# Altium schematic sheet Power.SchDoc
size A4; SheetNumber: 4; SheetTotal: 5; SPICEModelCacheOQVMKSBN: <root> / <DocumentId>OQVMKSBN</DocumentId> / </root>
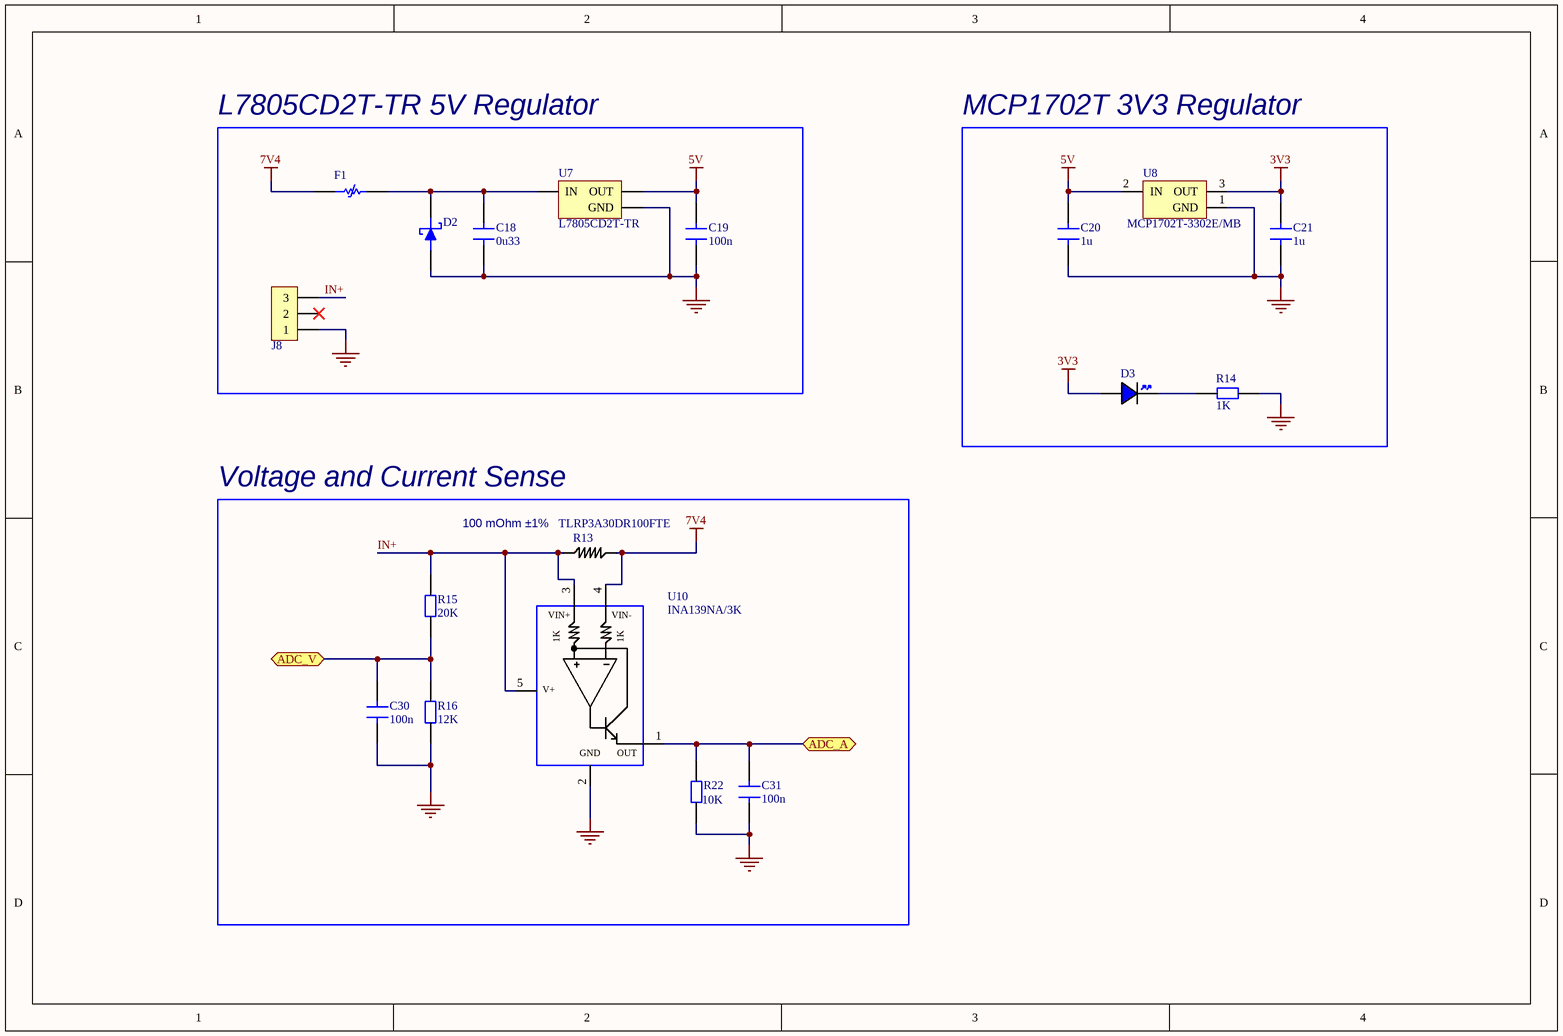
[diagram p0: Power.SchDoc]

## Parts
C18  0u33  [CAP 0805]
C19  100n  [CAP 0805]
C20  1u  [CAP 0805]
C21  1u  [CAP 0805]
C30  100n  [CAP 0805]
C31  100n  [CAP 0805]
D2  SMBJ8.5CA  [SMBJ12CA-13-F]  (value not drawn)
D3  LED 0805 BLUE  [LED 0805 BLUE]  (value not drawn)
F1  0ZCG0160AF2C  [0ZCG0075FF2C]  (value not drawn)
J8  JST B3B-XH-A  [JST_B3B-XH-A]  (value not drawn)
R13  TLRP3A30DR100FTE  [RES 2512]
R14  1K  [RES 0603]
R15  20K  [RES 0805]
R16  12K  [RES 0805]
R22  10K  [RES 0805]
U7  L7805CD2T-TR  [L7805ABD2T-TR]
U8  MCP1702T-3302E/MB  [MCP1702T-3302E/MB]
U10  INA139NA/3K  [INA139NA]

## Blocks framed on the sheet
L7805CD2T-TR 5V Regulator: C18 C19 D2 F1 J8 U7
MCP1702T 3V3 Regulator: C20 C21 D3 R14 U8
Voltage and Current Sense: C30 C31 R13 R15 R16 R22 U10

## Ports
ADC_A (bidir, see MCU[2C]), ADC_V (bidir, see MCU[2C])

## Nets
3V3: C21.2 D3.A U8.3(OUT)
5V: C19.2 C20.2 U7.3(OUT) U8.2(IN)
7V4: F1.1 R13.1 U10.4(VIN+)
GND: C18.1 C19.1 C20.1 C21.1 C30.1 C31.1 D2.1 J8.1 R14.2 R16.1 R22.1 U7.2(GND) U8.1(GND) U10.2(GND)
ADC_A: C31.2 R22.2 U10.1(OUT) ; port ADC_A
ADC_V: C30.2 R15.1 R16.2 ; port ADC_V
IN+: J8.3 R13.2 R15.2 U10.3(VIN+) U10.5(V+)
NetC18_2: C18.2 D2.2 F1.2 U7.1(IN)
NetD3_K: D3.K R14.1

Not connected (* = marked no-connect by the designer): J8 2*

## Notes on the sheet
- (near R13) 100 mOhm ±1%
- (in symbol INA139NA/3K) VIN-; 1K

## Library data of the parts
C18-C21 C30 C31 = CAP 0805 50V: Capacitor SMD 0805 50V
D2 = SMBJ8.5CA: Diode TVS Single Bi-Dir 8.5V 600W 2-Pin SMB; Manufacturer: Bourns; Number of Bidirectional Channels: 1; Min Breakdown Voltage: 9.44V; Clamping Voltage: 137V; Power Line Protection: No; Breakdown Voltage: 10.8V; Polarity: Bidirectional; Peak Pulse Current: 41.7A; Diode Type: ZENER; Reverse Breakdown Voltage: 94.4V; Operating Supply Voltage: 3.5V; Max Surge Current: 100A; Max Reverse Leakage Current: 40uA; Test Current: 1mA; Leakage Current: 1uA; Supplier 1: Avnet; Manufacturer Part Number: SMBJ8.5CA; RoHS: Yes; Category: TVS Diodes; Pricing 1: 12000=0,0994, 18000=0,0973, 30000=0,0952, 60000=0,0931, 120000=0,091, 600000=0,0889, 1200000=0,0875 (USD); Mount: Surface Mount; Case/Package: DO-214AA; Number of Pins: 2; Min Operating Temperature: -55°C; Max Operating Temperature: 150°C; Packaging: Tape and Reel; Reverse Standoff Voltage: 8.5V; Peak Pulse Power: 600W; Series: SMBJ; Direction: Bidirectional; Number of Channels: 1; Number of Elements: 1; Max Breakdown Voltage: 10.8V; Max Power Dissipation: 600W; Termination: SMD/SMT; Radiation Hardening: No; Reach SVHC Compliant: No; RoHS Compliant: Yes; ComponentLink1URL: https://datasheet.ciiva.com/4510/smbj-51809-4510857.pdf?src-supplier=Mouser; ComponentLink1Description: https://datasheet.ciiva.com/4510/smbj-51809-4510857.pdf?src-supplier=Mouser; ComponentLink2URL: https://datasheet.ciiva.com/3022/smbj-3022665.pdf?src-supplier=Avnet; ComponentLink2Description: https://datasheet.ciiva.com/3022/smbj-3022665.pdf?src-supplier=Avnet; ComponentLink3URL: https://datasheet.ciiva.com/3022/smbj-3022666.pdf?src-supplier=Avnet; ComponentLink3Description: https://datasheet.ciiva.com/3022/smbj-3022666.pdf?src-supplier=Avnet; ComponentLink4URL: https://datasheet.ciiva.com/334/smbj-334791.pdf?src-supplier=Digikey; ComponentLink4Description: https://datasheet.ciiva.com/334/smbj-334791.pdf?src-supplier=Digikey; ComponentLink5URL: https://datasheet.ciiva.com/334/smbj-334792.pdf?src-supplier=Digikey; ComponentLink5Description: https://datasheet.ciiva.com/334/smbj-334792.pdf?src-supplier=Digikey; ComponentLink6URL: https://datasheet.ciiva.com/334/smbj-334790.pdf?src-supplier=Digikey; ComponentLink6Description: https://datasheet.ciiva.com/334/smbj-334790.pdf?src-supplier=Digikey; ComponentLink7URL: https://datasheet.ciiva.com/3022/smbj-3022670.pdf?src-supplier=Avnet; ComponentLink7Description: https://datasheet.ciiva.com/3022/smbj-3022670.pdf?src-supplier=Avnet; ComponentLink8URL: https://datasheet.ciiva.com/334/smbj-334764.pdf?src-supplier=Digikey; ComponentLink8Description: https://datasheet.ciiva.com/334/smbj-334764.pdf?src-supplier=Digikey; ComponentLink9URL: https://datasheet.ciiva.com/334/smbj-334765.pdf?src-supplier=Digikey; ComponentLink9Description: https://datasheet.ciiva.com/334/smbj-334765.pdf?src-supplier=Digikey; ComponentLink10URL: https://datasheet.ciiva.com/334/smbj-334763.pdf?src-supplier=Digikey; ComponentLink10Description: https://datasheet.ciiva.com/334/smbj-334763.pdf?src-supplier=Digikey
D3 = LED 0805 BLUE: LED 0805 GREEN SMD
F1 = 0ZCG0160AF2C: Ptc Reset Fuse 12V 1.6A 1812; Manufacturer: Bel; Supplier 1: Mouser; Manufacturer Part Number: 0ZCG0160AF2C; RoHS: Yes; Category: PTC Resettable Fuses; Stock 1: 7947; Pricing 1: 1=0,24, 10=0,201, 50=0,201, 100=0,167, 1000=0,132, 10000=0,096 (USD); ComponentLink1URL: https://datasheet.ciiva.com/18550/0zcg-18550678.pdf?src-supplier=Digikey; ComponentLink1Description: https://datasheet.ciiva.com/18550/0zcg-18550678.pdf?src-supplier=Digikey; ComponentLink2URL: https://datasheet.ciiva.com/18550/0zcg-18550679.pdf?src-supplier=Digikey; ComponentLink2Description: https://datasheet.ciiva.com/18550/0zcg-18550679.pdf?src-supplier=Digikey; ComponentLink3URL: https://datasheet.ciiva.com/18550/0zcg-18550680.pdf?src-supplier=Digikey; ComponentLink3Description: https://datasheet.ciiva.com/18550/0zcg-18550680.pdf?src-supplier=Digikey
J8 = JST B3B-XH-A: Connector Header, XH Series, 3 Position, 2.50mm, Through Hole, Press-Fit, Solder, Natural; Manufacturer Part Number: B3B-XH-A(LF)(SN); Supplier 1: CoreStaff; Manufacturer: JST; RoHS: Yes; Category: Headers and Wire Housings; Stock 1: 2101; Pricing 1: 1=39,94, 10=25,1, 50=21,68, 100=18,25, 500=17,57, 1000=17,12, 2000=16,44, 4000=15,79 (JPY); ComponentLink1URL: https://datasheet.ciiva.com/26894/getdatasheetpartid-640434-26894454.pdf?src-supplier=Verical; ComponentLink1Description: https://datasheet.ciiva.com/26894/getdatasheetpartid-640434-26894454.pdf?src-supplier=Verical; ComponentLink2URL: https://datasheet.ciiva.com/26894/getdatasheetpartid-440399-26894778.pdf?src-supplier=Verical; ComponentLink2Description: https://datasheet.ciiva.com/26894/getdatasheetpartid-440399-26894778.pdf?src-supplier=Verical; ComponentLink3URL: https://datasheet.ciiva.com/11746/0900766b8082653f-11746520.pdf?src-supplier=Rs; ComponentLink3Description: https://datasheet.ciiva.com/11746/0900766b8082653f-11746520.pdf?src-supplier=Rs
R13 = TLRP3A30DR100FTE: Res, 0R1, 1%, 3W, Metal Strip, SMD Rohs Compliant: Yes; Manufacturer: TE Connectivity; Supplier 1: Farnell; Manufacturer Part Number: TLRP3A30DR100FTE; RoHS: No; Category: Chip SMD Resistors; Stock 1: 1580; Pricing 1: 10=0,393, 100=0,273, 500=0,221, 1000=0,179, 2000=0,177, 4000=0,166, 20000=0,163, 40000=0,159 (EUR)
R14 = RES 0603: Resistor SMD 0603
R15 R16 R22 = RES 0805: Resistor SMD 0805
U7 = L7805CD2T-TR: Standard Regulator Pos 5V 1.5A 3-Pin(2+Tab) D2PAK T/R / IC REG LDO 5V 1.5A D2PAK; Manufacturer: STMicroelectronics; Max Input Voltage: 35V; Number of Outputs: 1; Polarity: Positive; Quiescent Current: 8mA; Output Type: Fixed; Min Input Voltage: 10V; Dropout Voltage: 2V; Min Output Voltage: 4.8V; Power Supply Rejection Ratio (PSRR): 62dB; Supplier 1: Mouser; Manufacturer Part Number: L7805CD2T-TR; RoHS: Yes; Category: Voltage Regulators - Linear; Stock 1: 22923; Pricing 1: 1=0,85, 10=0,761, 50=0,723, 100=0,594, 1000=0,387, 10000=0,35 (USD); Mount: Surface Mount; Case/Package: TO-263; Number of Pins: 3; Weight: 7.1E-05oz; Min Operating Temperature: 0°C; Max Operating Temperature: 125°C; Output Voltage: 5V; Output Current: 1.5A; Packaging: Tape and Reel; Max Output Current: 1.5A; Package Quantity: 1000; Nominal Output Voltage: 5V; Number of Regulators: 1; Series: -; Length: 10.4mm; Width: 9.35mm; Height: 4.6mm; RoHS Compliant: Yes; Reach SVHC Compliant: No; Lead Free: Lead Free; ComponentLink1URL: https://datasheet.ciiva.com/36526/1991686-36526238.pdf?src-supplier=Jameco; ComponentLink1Description: https://datasheet.ciiva.com/36526/1991686-36526238.pdf?src-supplier=Jameco; ComponentLink2URL: https://datasheet.ciiva.com/1511/1805459-1511910.pdf?src-supplier=Element14; ComponentLink2Description: https://datasheet.ciiva.com/1511/1805459-1511910.pdf?src-supplier=Element14; ComponentLink3URL: https://datasheet.ciiva.com/2053/cd00000444-2053730.pdf?src-supplier=Digikey; ComponentLink3Description: https://datasheet.ciiva.com/2053/cd00000444-2053730.pdf?src-supplier=Digikey; ComponentLink4URL: https://datasheet.ciiva.com/4881/cd00000444-4881992.pdf?src-supplier=Mouser; ComponentLink4Description: https://datasheet.ciiva.com/4881/cd00000444-4881992.pdf?src-supplier=Mouser; ComponentLink5URL: https://datasheet.ciiva.com/16385/cd00000444-16385288.pdf?src-supplier=Future+Electronics; ComponentLink5Description: https://datasheet.ciiva.com/16385/cd00000444-16385288.pdf?src-supplier=Future+Electronics; ComponentLink6URL: https://datasheet.ciiva.com/46618/1805459-46618855.pdf?src-supplier=Newark; ComponentLink6Description: https://datasheet.ciiva.com/46618/1805459-46618855.pdf?src-supplier=Newark; ComponentLink7URL: https://datasheet.ciiva.com/22710/1805459-22710937.pdf?src-supplier=Element14; ComponentLink7Description: https://datasheet.ciiva.com/22710/1805459-22710937.pdf?src-supplier=Element14; ComponentLink8URL: https://datasheet.ciiva.com/7647/1805459-7647813.pdf?src-supplier=Element14; ComponentLink8Description: https://datasheet.ciiva.com/7647/1805459-7647813.pdf?src-supplier=Element14; ComponentLink9URL: https://datasheet.ciiva.com/2053/cd00000444-2053731.pdf?src-supplier=Digikey; ComponentLink9Description: https://datasheet.ciiva.com/2053/cd00000444-2053731.pdf?src-supplier=Digikey; ComponentLink10URL: https://datasheet.ciiva.com/2053/cd00000444-2053732.pdf?src-supplier=Digikey; ComponentLink10Description: https://datasheet.ciiva.com/2053/cd00000444-2053732.pdf?src-supplier=Digikey
U8 = MCP1702T-3302E/MB: LDO Regulator Pos 3.3V 0.25A Automotive 4-Pin(3+Tab) SOT-89 T/R; Manufacturer: Microchip; Max Supply Voltage: 13.2V; Min Supply Voltage: 2.7V; Dropout Voltage: 525mV; Output Current: 250mA; Number of Outputs: 1; Input Bias Current: 2uA; Quiescent Current: 5uA; Polarity: Positive; Accuracy: 2%; Output Type: Fixed; Supplier 1: Arrow Electronics; Manufacturer Part Number: MCP1702T-3302E/MB; RoHS: Yes; Category: Voltage Regulators - Linear; Stock 1: 26000; Pricing 1: 1000=0,4964 (USD); Mount: Surface Mount; Case/Package: SOT-89; Number of Pins: 3; Min Operating Temperature: -40°C; Max Operating Temperature: 125°C; Max Input Voltage: 13.2V; Min Input Voltage: 2.7V; Max Output Current: 250mA; Output Voltage: 3.3V; Packaging: Tape and Reel; Package Quantity: 1000; Nominal Output Voltage: 3.3V; Number of Regulators: 1; Min Output Voltage: 3.3V; Max Output Voltage: 3.3V; Termination: SMD/SMT; Output Voltage Accuracy: 2%; Supply Current: 5uA; Length: 4.6mm; Width: 2.29mm; Height: 1.6mm; Reach SVHC Compliant: No; Lead Free: Lead Free; RoHS Compliant: Yes
U10 = INA139NA/3K: 2.7 to 36V, 440kHz Variable gain current sense amplifier 5-SOT-23 -40 to 125; Manufacturer: Texas Instruments; Supplier 1: Mouser; Manufacturer Part Number: INA139NA/3K; RoHS: Yes; Category: Amplifiers - Op Amps, Buffer, Instrumentation; Stock 1: 20541; Pricing 1: 1=1,5, 10=1,27, 50=1,27, 100=1,02, 1000=0,737, 10000=0,736 (USD); ComponentLink1URL: https://datasheet.ciiva.com/15128/getdatasheetpartid-248784-15128606.pdf?src-supplier=Verical; ComponentLink1Description: https://datasheet.ciiva.com/15128/getdatasheetpartid-248784-15128606.pdf?src-supplier=Verical; ComponentLink2URL: https://datasheet.ciiva.com/1939/ina139-1939992.pdf?src-supplier=Digikey; ComponentLink2Description: https://datasheet.ciiva.com/1939/ina139-1939992.pdf?src-supplier=Digikey; ComponentLink3URL: https://datasheet.ciiva.com/1939/ina139-1939993.pdf?src-supplier=Digikey; ComponentLink3Description: https://datasheet.ciiva.com/1939/ina139-1939993.pdf?src-supplier=Digikey; ComponentLink4URL: https://datasheet.ciiva.com/1939/ina139-1939994.pdf?src-supplier=Digikey; ComponentLink4Description: https://datasheet.ciiva.com/1939/ina139-1939994.pdf?src-supplier=Digikey; ComponentLink5URL: https://datasheet.ciiva.com/2976/ina169-2976115.pdf?src-supplier=Avnet; ComponentLink5Description: https://datasheet.ciiva.com/2976/ina169-2976115.pdf?src-supplier=Avnet